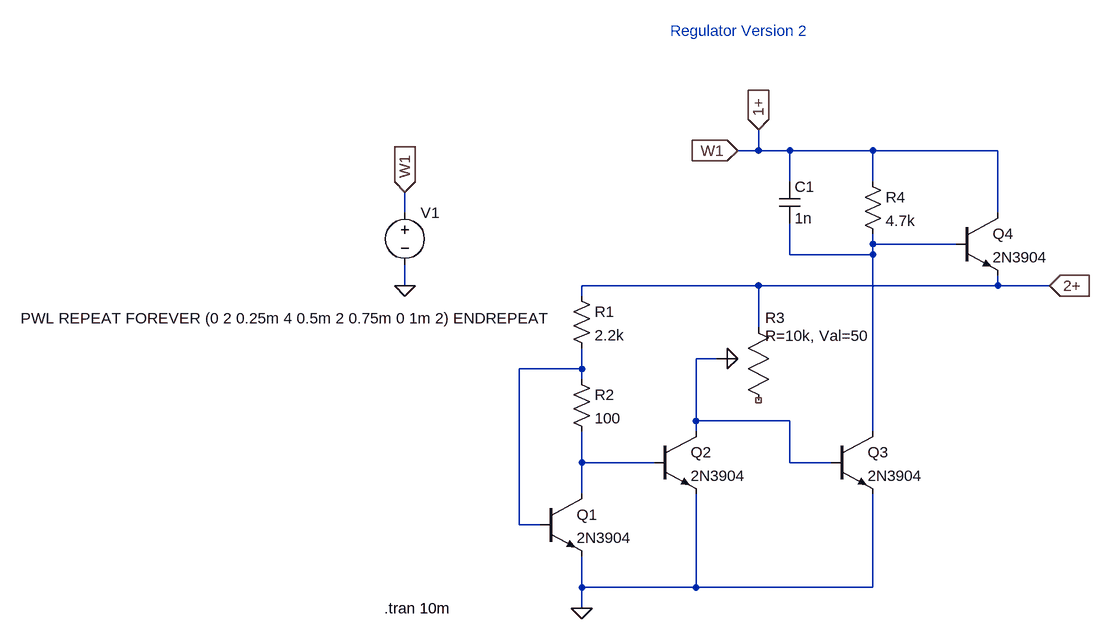
[diagram p0: schematic regulator_v2_ltspice.asc]
regulator_v2_ltspice.asc, the LTspice schematic file:
Version 4
SHEET 1 1136 680
WIRE 592 -320 592 -352
WIRE 592 -320 560 -320
WIRE 640 -320 592 -320
WIRE 768 -320 640 -320
WIRE 960 -320 768 -320
WIRE 640 -272 640 -320
WIRE 768 -272 768 -320
WIRE 48 -224 48 -256
WIRE 960 -224 960 -320
WIRE 768 -176 768 -192
WIRE 896 -176 768 -176
WIRE 640 -160 640 -208
WIRE 768 -160 768 -176
WIRE 768 -160 640 -160
WIRE 48 -112 48 -144
WIRE 592 -112 320 -112
WIRE 960 -112 960 -128
WIRE 960 -112 592 -112
WIRE 1040 -112 960 -112
WIRE 320 -96 320 -112
WIRE 592 -48 592 -112
WIRE 528 0 496 0
WIRE 320 16 320 -16
WIRE 320 16 224 16
WIRE 320 32 320 16
WIRE 496 96 496 0
WIRE 640 96 496 96
WIRE 496 112 496 96
WIRE 768 112 768 -160
WIRE 320 160 320 112
WIRE 432 160 320 160
WIRE 640 160 640 96
WIRE 704 160 640 160
WIRE 320 208 320 160
WIRE 224 256 224 16
WIRE 256 256 224 256
WIRE 320 352 320 304
WIRE 496 352 496 208
WIRE 496 352 320 352
WIRE 768 352 768 208
WIRE 768 352 496 352
WIRE 320 384 320 352
FLAG 320 384 0
FLAG 560 -320 W1
IOPIN 560 -320 In
FLAG 592 -352 1+
IOPIN 592 -352 In
FLAG 1040 -112 2+
IOPIN 1040 -112 In
FLAG 48 -112 0
FLAG 48 -256 W1
IOPIN 48 -256 In
SYMBOL npn 256 208 R0
SYMATTR InstName Q1
SYMATTR Value 2N3904
SYMBOL npn 432 112 R0
SYMATTR InstName Q2
SYMATTR Value 2N3904
SYMBOL npn 704 112 R0
SYMATTR InstName Q3
SYMATTR Value 2N3904
SYMBOL npn 896 -224 R0
SYMATTR InstName Q4
SYMATTR Value 2N3904
SYMBOL res 304 -112 R0
SYMATTR InstName R1
SYMATTR Value 2.2k
SYMBOL res 304 16 R0
SYMATTR InstName R2
SYMATTR Value 100
SYMBOL potentiometer 576 -32 R0
WINDOW 0 26 -31 Left 2
WINDOW 39 26 -3 Left 2
SYMATTR InstName R3
SYMATTR SpiceLine R=10k, Val=50
SYMBOL res 752 -288 R0
SYMATTR InstName R4
SYMATTR Value 4.7k
SYMBOL cap 624 -272 R0
SYMATTR InstName C1
SYMATTR Value 1n
SYMBOL voltage 48 -240 R0
WINDOW 3 -591 178 Left 2
WINDOW 123 0 0 Left 0
WINDOW 39 0 0 Left 0
SYMATTR InstName V1
SYMATTR Value PWL REPEAT FOREVER (0 2 0.25m 4 0.5m 2 0.75m 0 1m 2) ENDREPEAT
TEXT 16 384 Left 2 !.tran 10m
TEXT 456 -504 Left 2 ;Regulator Version 2

The netlist it stands for:
* regulator_v2_ltspice.asc
Q1 N004 N003 0 0 2N3904
Q2 N002 N004 0 0 2N3904
Q3 N001 N002 0 0 2N3904
Q4 1+ N001 2+ 0 2N3904
R1 2+ N003 2.2k
R2 N003 N004 100
XR3 2+ N002 NC_01 potentiometer R=10k, Val=50  ; pins 1 2 3
R4 1+ N001 4.7k
C1 1+ N001 1n
V1 1+ 0 PWL REPEAT FOREVER (0 2 0.25m 4 0.5m 2 0.75m 0 1m 2) ENDREPEAT
.model NPN NPN
.model PNP PNP
.lib standard.bjt
.tran 10m
* Regulator Version 2
.backanno
.end